# EAGLE design soloar Power (EAGLE 9.6.2)
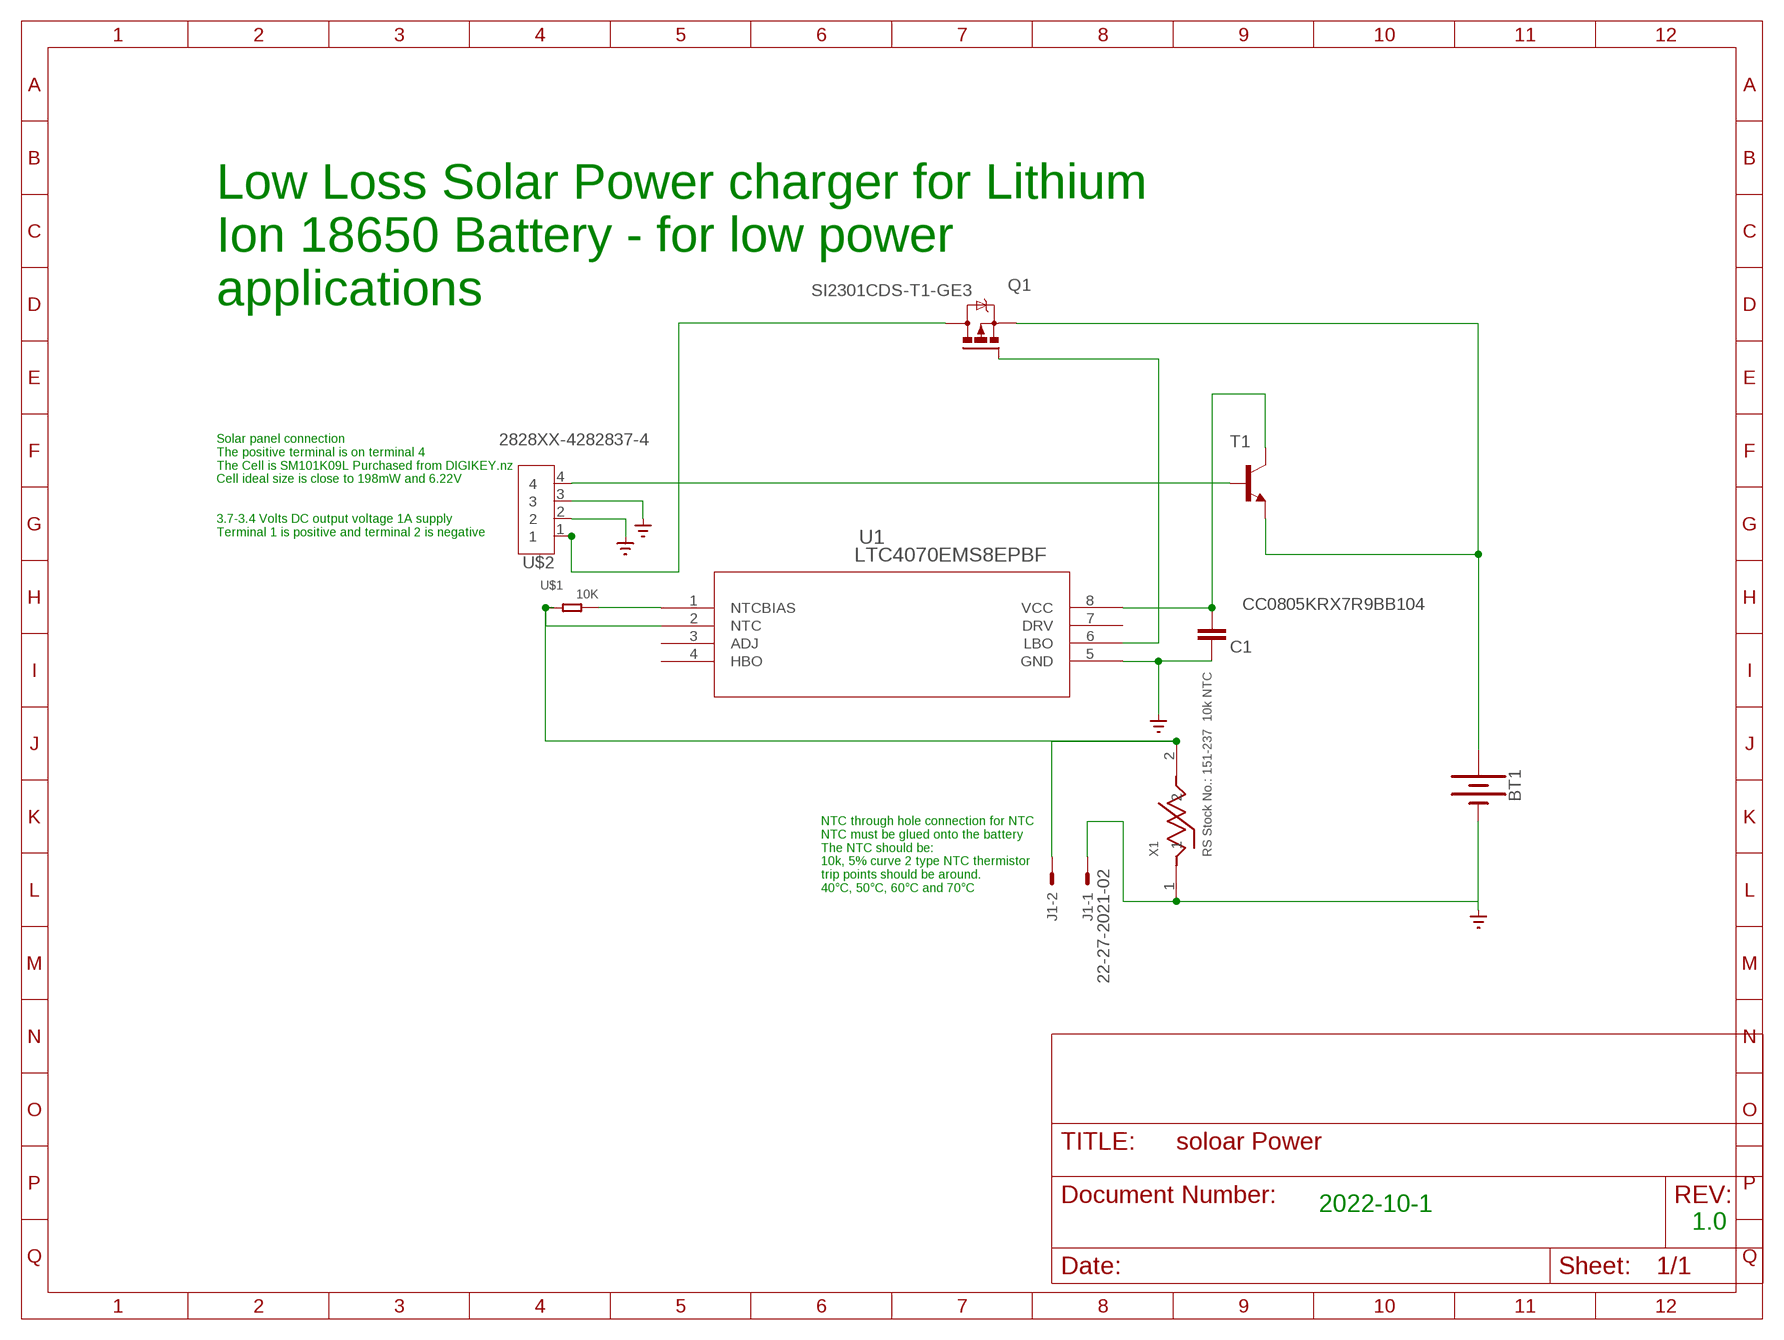
[diagram p0: schematic, sheet 1]

## Parts
BT1  BATTERY-18650  [BATTERY_18650-HOLDER]
C1  CC0805KRX7R9BB104  [CAP_0805]
J1  22-27-2021-02  [6410-02]
Q1  SI2301CDS-T1-GE3  PMOSFET__SOT23  [SOT23]
T1  MMBT3904LT1-NPN-SOT23-BEC  [SOT23-BEC]
U1  LTC4070EMS8EPBF  [MSOP-8_MS]
U$1  10K  SMD-RES-10K-1%-1/8W(0805)  [R0805]
U$2  2828XX-4282837-4  [TERMBLK_508-4N]
X1  RS Stock No.: 151-237 10k NTC  NCP18WF104J03RB  [NCP18WF104J03RB]

## Nets
GND: BT1.GND@1(-) C1.2 J1.1 U1.5(GND) U$2.2 U$2.3 X1.1 ; supply symbol labelled SUPPLY0_GND_
N$1: T1.B U$2.4
N$2: BT1.PWR@1(+) Q1.2(S) T1.E
N$3: C1.1 T1.C U1.8(VCC)
N$4: U1.1(NTCBIAS) U$1.1
N$5: Q1.3(D) U$2.1
N$6: J1.2 U1.2(NTC) U$1.2 X1.2
N$7: Q1.1(G) U1.6(LBO)
Unconnected: U1.3(ADJ) U1.4(HBO) U1.7(DRV)

## Notes on the sheet
- Low Loss Solar Power charger for Lithium
  Ion 18650 Battery - for low power
  applications
- Solar panel connection 
  The positive terminal is on terminal 4
  The Cell is SM101K09L Purchased from DIGIKEY.nz
  Cell ideal size is close to 198mW and 6.22V
- 3.7-3.4 Volts DC output voltage 1A supply
  Terminal 1 is positive and terminal 2 is negative
- NTC through hole connection for NTC
  NTC must be glued onto the battery
  The NTC should be:
  10k, 5% curve 2 type NTC thermistor
  trip points should be around.
  40°C, 50°C, 60°C and 70°C
- 2022-10-1
- 1.0

## Library data of the parts
BT1 = SparkFun-Batteries:BATTERY: Battery - Single Cell A variety of battery chemistries, sizes, and footprints. Device List: 20MM_PTH - Coin Cell Battery Holder - 20mm (PTH) <https://www.sparkfun.com/products/783> 6.8MM_PTH - Coin Cell Battery Holder - 6.8MM(SMD) <https://www.digikey.com/product-detail/en/seiko-instruments/MS621FE-FL11E/728-1057-ND/1889208?WT.srch=1&gclid=CNOQ5a6LzdQCFZS2wAodXCkE0g> 12MM_SMD - Coin Cell Battery Holder - 12mm (SMD) <https://www.sparkfun.com/products/10592> 12MM_PTH - Coin Cell Battery Holder - 12mm (PTH) <https://www.sparkfun.com/products/7948> 20MM_SMD - 20mm Coin Cell Battery Holder (SMD) (2 legs) Used on the Big Time Watch Kit <https://www.sparkfun.com/products/11734> 20MM_SMD_4LEGS - Coin Cell Battery Holder - 20mm (SMD) <https://www.sparkfun.com/products/11892> 20MM_SMD_4LEGS_OVERPASTE - Coin Cell Battery Holder - 20mm (SMD) <https://www.sparkfun.com/products/11892> (Over-paste on the legs) 24.5MM_PTH - Coin Cell Battery Holder - 24.5mm (PTH) <https://www.sparkfun.com/products/8863> 9V - 9V Battery Holder - PC Mount Used on the SparkFun SparkPunk Sound Kit <https://www.sparkfun.com/products/11177> and SparkFun SparkPunk Sequencer Kit <https://www.sparkfun.com/products/12707> 18650 - Battery Holder - 18650 (PTH) <https://www.sparkfun.com/products/13113> AA - Battery Holder - 1xAA (PTH) <https://www.sparkfun.com/products/7949> AAA - Battery Holder - 1xAAA (PTH) <https://www.sparkfun.com/products/12718> AA_KIT - Battery Holder - 1xAA (PTH) <https://www.sparkfun.com/products/7949> Special kit package - pads only have exposed copper on one side of the board. AAA_KIT - Battery Holder - 1xAAA (PTH) <https://www.sparkfun.com/products/12718> Special kit package - pads only have exposed copper on one side of the board.; PROD_ID: BATT-12327; SF_SKU: PRT-13113
C1 = Resistor_Capacitor:CC0805KRX7R9BB104: CAP CER 0.1UF 50V X7R 0805 Manufacturer's datasheet <http://www.yageo.com/documents/recent/UPY-GPHC_X7R_6.3V-to-50V_18.pdf>; CREATED_BY: PCBLayout.com; DIGIKEY_PART_NUMBER: 311-1140-2-ND; MANUFACTURER: Yageo; MPN: CC0805KRX7R9BB104; PACKAGE: SMD 0805
J1 = con-molex:22-?-02: CONNECTOR wire to board 2.54 mm (.1 inch) pitch header; MF: MOLEX; OC_FARNELL: unknown; OC_NEWARK: unknown
Q1 = Tinkercad:PMOSFET: P-Channel MOSFET - Generic; CATEGORY: Transistor; SUB-CATEGORY: MOSFET; TYPE: P-Channel; VALUE: PMOSFET
T1 = transistor:*-NPN-: NPN Transistror BF959 corrected 2008.03.06
U1 = LTC4070EMS8EPBF:LTC4070EMS8EPBF: Check availability <https://pricing.snapeda.com/parts/LTC4070EMS8E%23PBF/Analog%20Devices/view-part?ref=eda>; AVAILABILITY: In Stock; DESCRIPTION: Charger IC Lithium Ion/Polymer 8-MSOP-EP; MF: Analog Devices; MP: LTC4070EMS8E#PBF; PACKAGE: MSOP -8 Analog Devices; PRICE: None; PURCHASE-URL: https://pricing.snapeda.com/search/part/LTC4070EMS8E#PBF/?ref=eda
U$1 = OPL_Resistor:SMD-RES-10K-1%-1/8W(0805): 301012152; MPN: RC0805FR-0710KL
U$2 = Connector:2828XX-4: 4 Position Wire to Board Terminal Block Horizontal with Board Datasheet <https://www.te.com.cn/commerce/DocumentDelivery/DDEController?Action=showdoc&DocId=Catalog+Section%7F1308389_EUROSTYLE_TERMINAL_BLOCKS%7F0607%7Fpdf%7FEnglish%7FENG_CS_1308389_EUROSTYLE_TERMINAL_BLOCKS_0607.pdf%7F2-282837-5>; CATEGORY: Connector; DESCRIPTION: TERM BLK 4P SIDE ENT 5.08mm PCB; MANUFACTURER: TE Connectivity; MPN: 282837-4; OPERATING_TEMPERATURE: 40°C to +105°C; PART_STATUS: Active; ROHS_COMPLIANCE: RoHS Compliant; SERIES: 283737; SUBCATEGORY: Terminal Block; TYPE: Side Wire Entry
X1 = Thermistor_Inductors:NCP18WF104J03RB: THERM NTC 100KOHM 4250K 0603 Manufacturer's datasheet <https://www.murata.com/~/media/webrenewal/support/library/catalog/products/thermistor/ntc/r44e.ashx?la=en-us>; CREATED_BY: PCBLayout.com; DIGIKEY_PART_NUMBER: 490-2430-2-ND; MANUFACTURER: Murata Electronics North America; MPN: NCP18WF104J03RB; PACKAGE: 0603

## Board
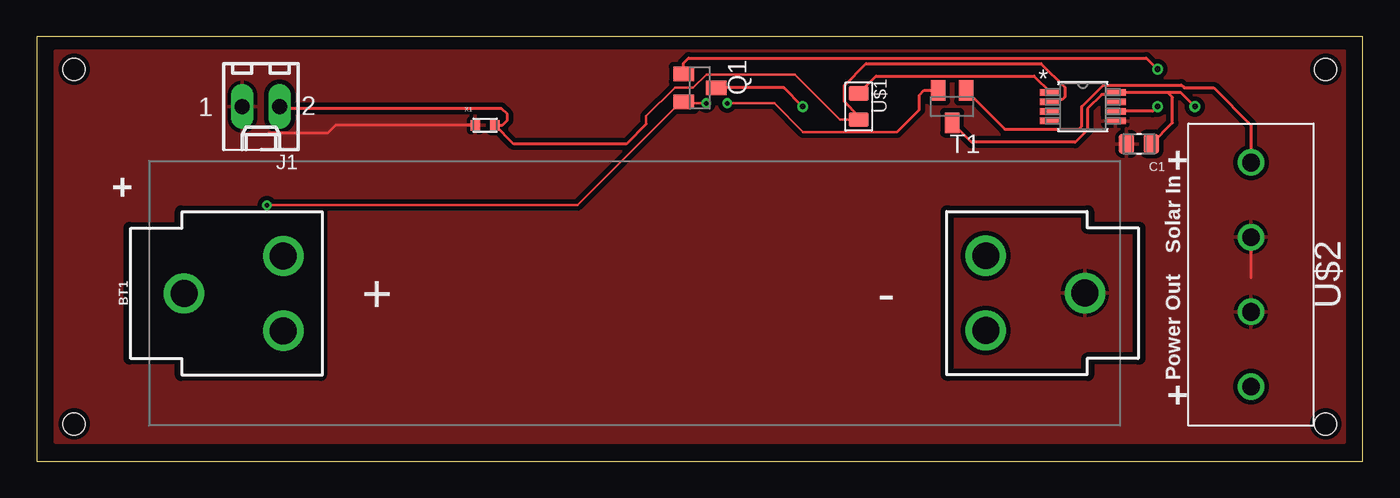
[diagram p1: board, top side]
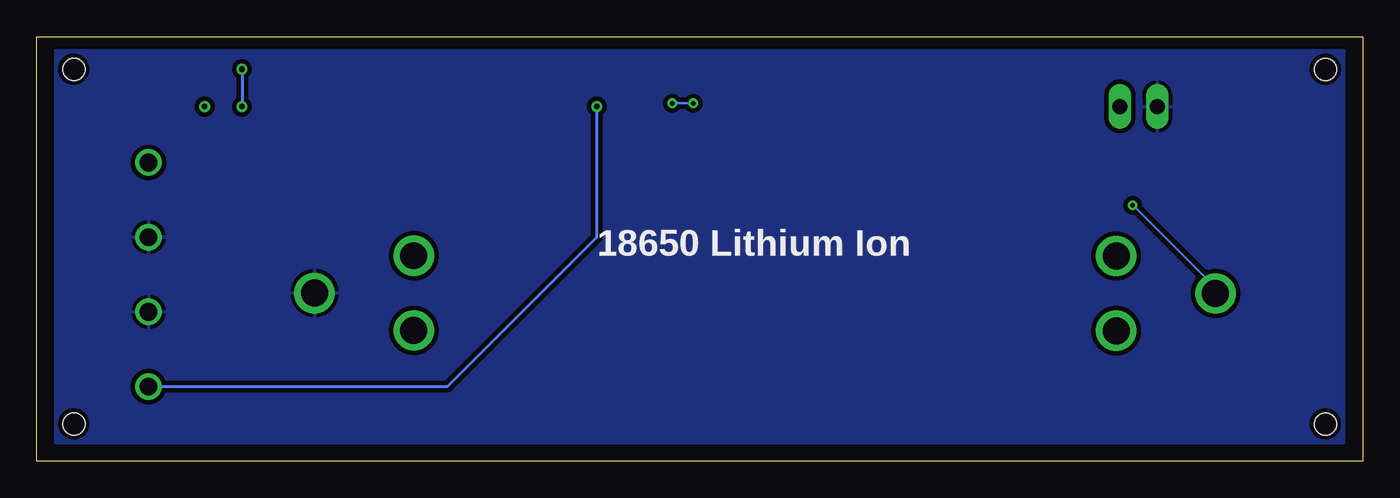
[diagram p2: board, bottom side, seen from below]

Size 90.15 x 28.88 mm. Coordinates in mm from the lower left corner, seen from the top.
Outline: 0,0 90.15,0 90.15,28.88 0,28.88 0,0
Copper layers (1*16): Top 0.035mm / dielectric 1.5mm / Bottom 0.035mm
Design rules "SparkFun-2-Layer-General-JLCPCB": minimum track width 7mil, minimum drill 0.3mm, track to track 7mil, track to pad 7mil, pad to pad 7mil, via to via 7mil, smd to smd 7mil, copper to edge 7mil, drill to drill 7mil, minimum pad ring 7mil, minimum via ring 7mil, stop-mask expansion 3mil, vias tented up to drill 25mil, thermal gap 10mil
Holes 1.5 mm at 87.63,26.67 2.54,26.67 2.54,2.54 87.63,2.54

### Footprints (pad centres in the part's own frame; a part is rotated, then mirrored left to right if it is on the bottom)
BATTERY_18650-HOLDER = drill 1.829: GND@1 30.628,0.01; GND@2 23.88,2.55; GND@3 23.88,-2.53; PWR@1 -30.628,-0.01; PWR@2 -23.88,2.53; PWR@3 -23.88,-2.55
CAP_0805 = smd 1.05 x 1.38: 1 -0.84,0; 2 0.84,0
6410-02 = drill 1.016 long: 1 1.27,0; 2 -1.27,0
SOT23 = smd 1 x 1.4: 1 -0.95,-1.1; 2 0.95,-1.1; 3 0,1.1
SOT23-BEC = smd 1 x 1.4: B -0.95,-1.1; C 0,1.1; E 0.95,-1.1
MSOP-8_MS = smd 1.397 x 0.432: 1 -2.21,0.975; 2 -2.21,0.325; 3 -2.21,-0.325; 4 -2.21,-0.975; 5 2.21,-0.975; 6 2.21,-0.325; 7 2.21,0.325; 8 2.21,0.975
R0805 = smd 1.397 x 1.016: 1 0,0.889; 2 0,-0.889
TERMBLK_508-4N = drill 1.2: 1 0,0; 2 5.08,0; 3 10.16,0; 4 15.24,0
NCP18WF104J03RB = smd 0.65 x 0.7: 1 -0.675,0; 2 0.675,0

### Placement (x,y rotation side)
BT1  40.64,11.43 0 top
C1  74.93,21.59 180 top
J1  15.24,24.13 180 top
Q1  45.09,25.4 270 top
T1  62.23,24.13 180 top
U1  71.12,24.13 0 top
U$1  55.88,24.13 0 top
U$2  82.55,5.08 90 top
X1  30.48,22.86 0 top

### Tracks (layer width: path | path; a pad name or v marks a point on that pad's centre or on a via)
GND
  Top 0.2: U$2.3 82.55,12.5 | X1.1 20.32,22.86 19.79,22.33 15.77,22.33
  pour Top (isolate 0.305): 1.27,27.94 88.9,27.94 88.9,1.27 1.27,1.27
  pour Bottom (isolate 0.305): 1.27,27.94 88.9,27.94 88.9,1.27 1.27,1.27
N$1
  Top 0.2: T1.B 65.82,22.59 70.85,22.59 71.05,22.79 71.05,24.14 72.52,25.6 77.81,25.6 78,25.4 80.01,25.4 82.55,22.86 U$2.4
N$2  (via drill 0.3)
  Top 0.178: v46.94,24.36 50.14,24.36 52.09,22.4 58.5,22.4 | v15.65,17.42 36.76,17.42 43.78,24.45 Q1.2 44.08,24.36 v45.52,24.36
  Top 0.2: 58.5,22.4 60,23.91 60,24.9 60.33,25.23 T1.E
  Bottom 0.178: v46.94,24.36 v45.52,24.36 | 10.13,11.91 v15.65,17.42
  Bottom 0.2: BT1.PWR@1 10.01,11.79 10.13,11.91
N$3  (via drill 0.38)
  Top 0.2: C1.1 77.22,23.04 77.22,24.77 76.88,25.11 U1.8 | U1.8 77.77,25.11 v78.74,24.13 | U1.8 73.17,24.95 72.4,24.95 71.43,23.98 71.43,22.53 70.6,21.7 63.56,21.7 T1.C
N$4
  Top 0.2: U$1.1 57.07,26.21 67.81,26.21 U1.1
N$5  (via drill 0.38)
  Top 0.2: v52.07,24.13 50.8,25.4 Q1.3
  Bottom 0.2: U$2.1 62.23,5.08 52.07,15.24 v52.07,24.13
N$6
  Top 0.178: 41.43,22.94 41.43,23.47 43.38,25.43 44.63,25.43 45.52,26.31 51.54,26.31 54.61,23.24 U$1.2
  Top 0.2: U$1.2 55.88,23.49 54.9,24.47 54.9,25.57 56.38,27.05 68.28,27.05 69.89,25.44 69.89,24.77 69.72,24.61 69.07,24.61 U1.2 | 41.43,22.94 40.08,21.59 32.42,21.59 X1.2 31.66,22.86 32,23.2 32,23.6 31.6,24 16.64,24 J1.2
N$7  (via drill 0.38)
  Top 0.2: Q1.1 43.98,27.09 44.32,27.43 75.44,27.43 v76.2,26.67 | v76.2,24.13 75.88,23.8 U1.6
  Bottom 0.2: v76.2,26.67 v76.2,24.13

### Text on the board
tPlace: + | + | Solar In | Power Out | +
bPlace: 18650 Lithium Ion
_tNames: U$1 | C1 | X1 | T1 | J1 | U$2 | BT1